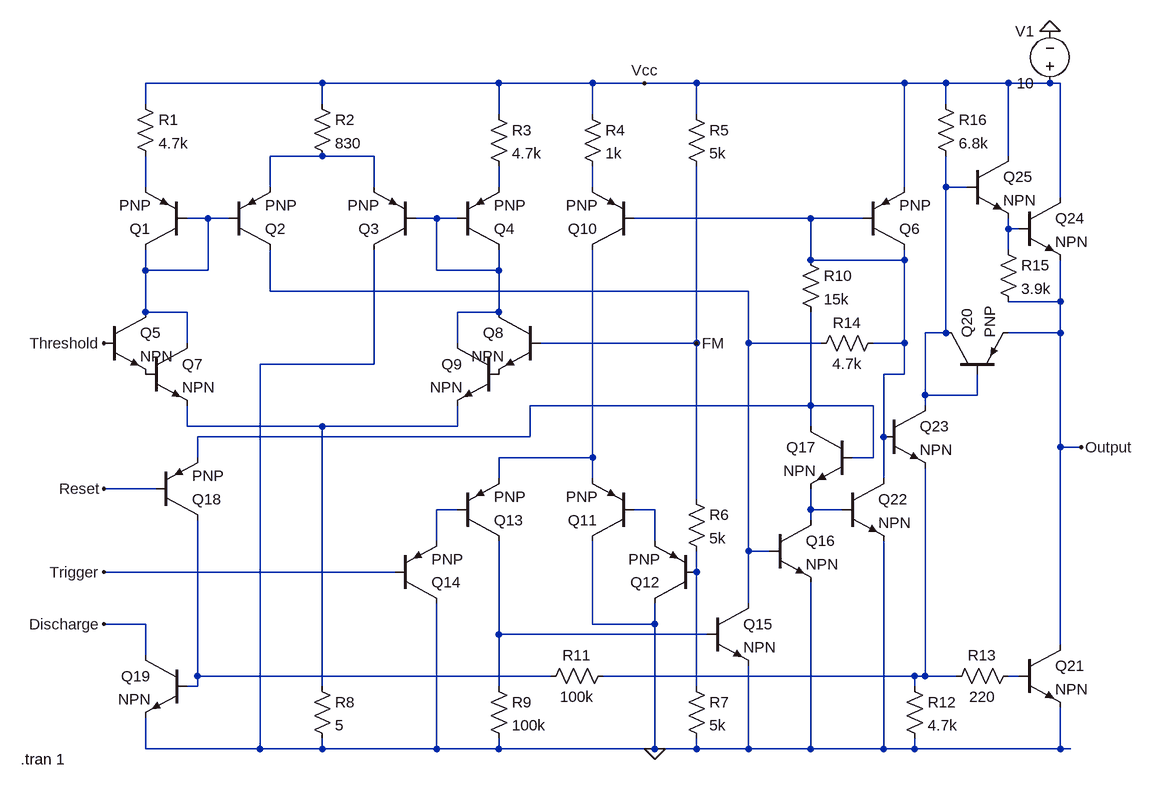
[diagram p0: schematic oscillator_555.asc]
oscillator_555.asc, the LTspice schematic file:
Version 4.1
SHEET 1 1620 1040
WIRE 352 -16 80 -16
WIRE 624 -16 352 -16
WIRE 768 -16 624 -16
WIRE 848 -16 768 -16
WIRE 928 -16 848 -16
WIRE 1248 -16 928 -16
WIRE 1312 -16 1248 -16
WIRE 1408 -16 1312 -16
WIRE 1472 -16 1408 -16
WIRE 1488 -16 1472 -16
WIRE 80 16 80 -16
WIRE 352 16 352 -16
WIRE 1312 16 1312 -16
WIRE 624 32 624 -16
WIRE 768 32 768 -16
WIRE 928 32 928 -16
WIRE 352 96 272 96
WIRE 432 96 352 96
WIRE 1408 96 1408 -16
WIRE 80 144 80 96
WIRE 272 144 272 96
WIRE 432 144 432 96
WIRE 624 144 624 112
WIRE 768 144 768 112
WIRE 1248 144 1248 -16
WIRE 1312 144 1312 96
WIRE 1344 144 1312 144
WIRE 1488 160 1488 -16
WIRE 176 192 144 192
WIRE 208 192 176 192
WIRE 528 192 496 192
WIRE 560 192 528 192
WIRE 1104 192 832 192
WIRE 1184 192 1104 192
WIRE 1408 208 1408 192
WIRE 1424 208 1408 208
WIRE 1408 240 1408 208
WIRE 1104 256 1104 192
WIRE 1248 256 1248 240
WIRE 1248 256 1104 256
WIRE 80 272 80 240
WIRE 176 272 176 192
WIRE 176 272 80 272
WIRE 528 272 528 192
WIRE 624 272 624 240
WIRE 624 272 528 272
WIRE 272 304 272 240
WIRE 1008 304 272 304
WIRE 1488 320 1488 256
WIRE 1488 320 1408 320
WIRE 80 336 80 272
WIRE 144 336 80 336
WIRE 624 336 624 272
WIRE 624 336 560 336
WIRE 1312 368 1312 144
WIRE 1312 368 1280 368
WIRE 1488 368 1488 320
WIRE 1488 368 1408 368
WIRE 144 384 144 336
WIRE 560 384 560 336
WIRE 928 384 928 112
WIRE 928 384 688 384
WIRE 1008 384 1008 304
WIRE 1120 384 1008 384
WIRE 1248 384 1248 256
WIRE 1248 384 1200 384
WIRE 432 416 432 240
WIRE 432 416 256 416
WIRE 1248 432 1248 384
WIRE 1248 432 1216 432
WIRE 1280 464 1280 368
WIRE 1360 464 1360 432
WIRE 1360 464 1280 464
WIRE 1104 480 1104 336
WIRE 1104 480 672 480
WIRE 1200 480 1104 480
WIRE 1280 480 1280 464
WIRE 144 512 144 480
WIRE 352 512 144 512
WIRE 560 512 560 480
WIRE 560 512 352 512
WIRE 1104 512 1104 480
WIRE 672 528 672 480
WIRE 672 528 160 528
WIRE 1216 528 1216 432
WIRE 1488 544 1488 368
WIRE 1520 544 1488 544
WIRE 160 560 160 528
WIRE 768 560 768 240
WIRE 768 560 624 560
WIRE 1200 560 1200 480
WIRE 1200 560 1168 560
WIRE 624 592 624 560
WIRE 768 592 768 560
WIRE 1216 592 1216 528
WIRE 96 608 16 608
WIRE 928 624 928 384
WIRE 560 640 528 640
WIRE 864 640 832 640
WIRE 1104 640 1104 608
WIRE 1152 640 1104 640
WIRE 1104 656 1104 640
WIRE 528 688 528 640
WIRE 864 688 864 640
WIRE 1008 704 1008 384
WIRE 1040 704 1008 704
WIRE 464 736 16 736
WIRE 928 736 928 704
WIRE 1008 784 1008 704
WIRE 80 816 16 816
WIRE 768 816 768 688
WIRE 864 816 864 784
WIRE 864 816 768 816
WIRE 624 832 624 688
WIRE 944 832 624 832
WIRE 1488 848 1488 544
WIRE 80 864 80 816
WIRE 160 896 160 656
WIRE 704 896 160 896
WIRE 1264 896 784 896
WIRE 1280 896 1280 576
WIRE 1280 896 1264 896
WIRE 1328 896 1280 896
WIRE 1424 896 1408 896
WIRE 160 912 160 896
WIRE 160 912 144 912
WIRE 352 912 352 512
WIRE 624 912 624 832
WIRE 928 912 928 736
WIRE 1264 912 1264 896
WIRE 80 1008 80 960
WIRE 256 1008 256 416
WIRE 256 1008 80 1008
WIRE 352 1008 352 992
WIRE 352 1008 256 1008
WIRE 528 1008 528 784
WIRE 528 1008 352 1008
WIRE 624 1008 624 992
WIRE 624 1008 528 1008
WIRE 864 1008 864 816
WIRE 864 1008 624 1008
WIRE 928 1008 928 992
WIRE 928 1008 864 1008
WIRE 1008 1008 1008 880
WIRE 1008 1008 928 1008
WIRE 1104 1008 1104 752
WIRE 1104 1008 1008 1008
WIRE 1216 1008 1216 688
WIRE 1216 1008 1104 1008
WIRE 1264 1008 1264 992
WIRE 1264 1008 1216 1008
WIRE 1488 1008 1488 944
WIRE 1488 1008 1264 1008
WIRE 1504 1008 1488 1008
FLAG 16 384 Threshold
FLAG 16 736 Trigger
FLAG 928 384 FM
FLAG 16 816 Discharge
FLAG 16 608 Reset
FLAG 1520 544 Output
FLAG 848 -16 Vcc
FLAG 1472 -96 0
FLAG 864 1008 0
SYMBOL res 64 0 R0
SYMATTR InstName R1
SYMATTR Value 4.7k
SYMBOL res 336 0 R0
SYMATTR InstName R2
SYMATTR Value 830
SYMBOL res 608 16 R0
SYMATTR InstName R3
SYMATTR Value 4.7k
SYMBOL res 752 16 R0
SYMATTR InstName R4
SYMATTR Value 1k
SYMBOL res 912 16 R0
SYMATTR InstName R5
SYMATTR Value 5k
SYMBOL pnp 144 240 R180
SYMATTR InstName Q1
SYMBOL pnp 208 240 M180
SYMATTR InstName Q2
SYMBOL pnp 496 240 R180
SYMATTR InstName Q3
SYMBOL pnp 560 240 M180
SYMATTR InstName Q4
SYMBOL pnp 1184 240 M180
SYMATTR InstName Q6
SYMBOL npn 16 336 R0
SYMATTR InstName Q5
SYMBOL npn 80 384 R0
SYMATTR InstName Q7
SYMBOL npn 688 336 M0
SYMATTR InstName Q8
SYMBOL npn 624 384 M0
SYMATTR InstName Q9
SYMBOL pnp 832 240 R180
SYMATTR InstName Q10
SYMBOL res 912 608 R0
SYMATTR InstName R6
SYMATTR Value 5k
SYMBOL res 912 896 R0
SYMATTR InstName R7
SYMATTR Value 5k
SYMBOL res 336 896 R0
SYMATTR InstName R8
SYMATTR Value 5
SYMBOL pnp 832 688 R180
SYMATTR InstName Q11
SYMBOL pnp 928 784 R180
SYMATTR InstName Q12
SYMBOL pnp 560 688 M180
SYMATTR InstName Q13
SYMBOL pnp 464 784 M180
SYMATTR InstName Q14
SYMBOL res 608 896 R0
SYMATTR InstName R9
SYMATTR Value 100k
SYMBOL npn 944 784 R0
SYMATTR InstName Q15
SYMBOL npn 1040 656 R0
SYMATTR InstName Q16
SYMBOL npn 1168 512 M0
SYMATTR InstName Q17
SYMBOL res 1088 240 R0
SYMATTR InstName R10
SYMATTR Value 15k
SYMBOL pnp 96 656 M180
SYMATTR InstName Q18
SYMBOL npn 144 864 M0
SYMATTR InstName Q19
SYMBOL res 800 880 R90
WINDOW 0 0 56 VBottom 2
WINDOW 3 32 56 VTop 2
SYMATTR InstName R11
SYMATTR Value 100k
SYMBOL res 1248 896 R0
SYMATTR InstName R12
SYMATTR Value 4.7k
SYMBOL npn2 1424 848 R0
SYMATTR InstName Q21
SYMBOL res 1424 880 R90
WINDOW 0 0 56 VBottom 2
WINDOW 3 32 56 VTop 2
SYMATTR InstName R13
SYMATTR Value 220
SYMBOL npn 1152 592 R0
SYMATTR InstName Q22
SYMBOL npn 1216 480 R0
SYMATTR InstName Q23
SYMBOL res 1216 368 R90
WINDOW 0 0 56 VBottom 2
WINDOW 3 32 56 VTop 2
SYMATTR InstName R14
SYMATTR Value 4.7k
SYMBOL pnp 1312 432 R270
SYMATTR InstName Q20
SYMBOL npn2 1424 160 R0
SYMATTR InstName Q24
SYMBOL res 1392 224 R0
SYMATTR InstName R15
SYMATTR Value 3.9k
SYMBOL res 1296 0 R0
SYMATTR InstName R16
SYMATTR Value 6.8k
SYMBOL npn 1344 96 R0
SYMATTR InstName Q25
SYMBOL voltage 1472 0 R180
WINDOW 0 24 96 Left 2
WINDOW 3 24 16 Left 2
SYMATTR InstName V1
SYMATTR Value 10
TEXT -112 1024 Left 2 !.tran 1

The netlist it stands for:
* oscillator_555.asc
R1 Vcc N002 4.7k
R2 Vcc N001 830
R3 Vcc N003 4.7k
R4 Vcc N004 1k
R5 Vcc FM 5k
Q1 N006 N006 N002 0 PNP
Q2 N010 N006 N001 0 PNP
Q3 0 N007 N001 0 PNP
Q4 N007 N007 N003 0 PNP
Q6 N008 N008 Vcc 0 PNP
Q5 N006 Threshold P001 0 NPN
Q7 N006 P001 N012 0 NPN
Q8 N007 FM P002 0 NPN
Q9 N007 P002 N012 0 NPN
Q10 N013 N008 N004 0 PNP
R6 FM N017 5k
R7 N017 0 5k
R8 N012 0 5
Q11 0 N015 N013 0 PNP
Q12 0 N017 N015 0 PNP
Q13 N018 N014 N013 0 PNP
Q14 0 Trigger N014 0 PNP
R9 N018 0 100k
Q15 N010 N018 0 0 NPN
Q16 N016 N010 0 0 NPN
Q17 N011 N011 N016 0 NPN
R10 N008 N011 15k
Q18 N019 Reset N011 0 PNP
Q19 Discharge N019 0 0 NPN
R11 N020 N019 100k
R12 N020 0 4.7k
Q21 Output N021 0 0 NPN
R13 N021 N020 220
Q22 N008 N016 0 0 NPN
Q23 N005 N008 N020 0 NPN
R14 N008 N010 4.7k
Q20 N005 N005 Output 0 PNP
Q24 Vcc N009 Output 0 NPN
R15 N009 Output 3.9k
R16 Vcc N005 6.8k
Q25 Vcc N005 N009 0 NPN
V1 Vcc 0 10
.model NPN NPN
.model PNP PNP
.lib standard.bjt
.tran 1
.backanno
.end